# Altium project KX134-1211 Angela Rallos.Prjcb.PrjPcb
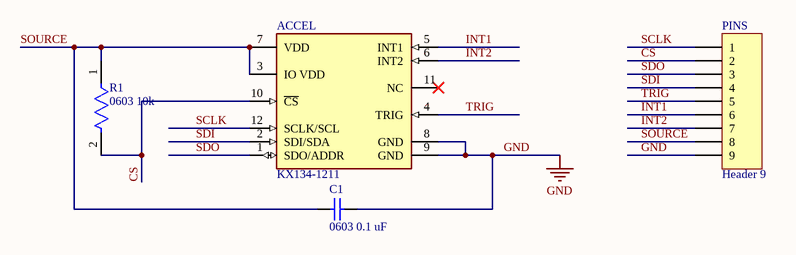
[diagram p0: Sheet1.SchDoc]
1 sheet, 4 parts. Net scope: global (net labels, ports and power ports of the same name join across sheets).
Board file: PCB1.PcbDoc

## Sheet Sheet1.SchDoc
size A; SheetNumber: 1; SheetTotal: 1

### Parts
ACCEL  KX134-1211  [FP-KX134-1211-MFG]
C1  0603 0.1 uF  [CAPC1608X95X40NL15T15]
PINS  Header 9  [HDR1X9]
R1  0603 10k  [FP-CRCW0603-e3-IPC_C]

### Nets
GND: ACCEL.8(GND) ACCEL.9(GND) C1.2 PINS.9
CS: ACCEL.10(~{CS}) PINS.2 R1.2
INT1: ACCEL.5(INT1) PINS.6
INT2: ACCEL.6(INT2) PINS.7
SCLK: ACCEL.12(SCLK/SCL) PINS.1
SDI: ACCEL.2(SDI/SDA) PINS.4
SDO: ACCEL.1(SDO/ADDR) PINS.3
SOURCE: ACCEL.3(IO_VDD) ACCEL.7(VDD) C1.1 PINS.8 R1.1
TRIG: ACCEL.4(TRIG) PINS.5

Not connected (* = marked no-connect by the designer): ACCEL 11(NC)*

### Library data of the parts
ACCEL = CMP-223024-000001-1: 105C OPERATING HIGHER BANDWIDTH,
C1 = CMP-2006-01670-1: Part Number: VJ0603A101KXBCW1BC; Manufacturer: Vitramon
PINS = Header 9: Header, 9-Pin; LatestRevisionDate: 17-Jul-2002; LatestRevisionNote: Re-released for DXP Platform.; Publisher: Altium Limited
R1 = CMP-2000-03828-2: RES Thick Film, 100Ω, 5%, 0.1W, 200ppm/°C, 0603; Voltage Rating (DC): 75V; Power Rating: 100mW; Resistance: 100R; Tolerance: 5%; Series: CRCW; Voltage Rating: 75V; Case Code (Metric): 1608; Lead Free: Lead Free; Length: 1.55mm; Height: 0.02inch; Contact Plating: Tin; Max Power Dissipation: 100mW; Temperature Coefficient: 200ppm/°C; Package Quantity: 10000; Depth: 0.85mm; Construction: Rectangular; Resistor Type: Thick Film; Resistance Tolerance: 5%; RoHS Compliant: Yes; Packaging: Tape and Reel; Number of Terminations: 2; Military Standard: Not; Case/Package: 0603; Case Code (Imperial): 0603; Features: Automotive AEC-Q200; Radiation Hardening: No; Min Operating Temperature: -55°C; Width: 0.033inch; Weight: 7.1E-05oz; Max Operating Temperature: 155°C